# EAGLE schematic roomba_wall_v2_c (EAGLE 7.6.0)
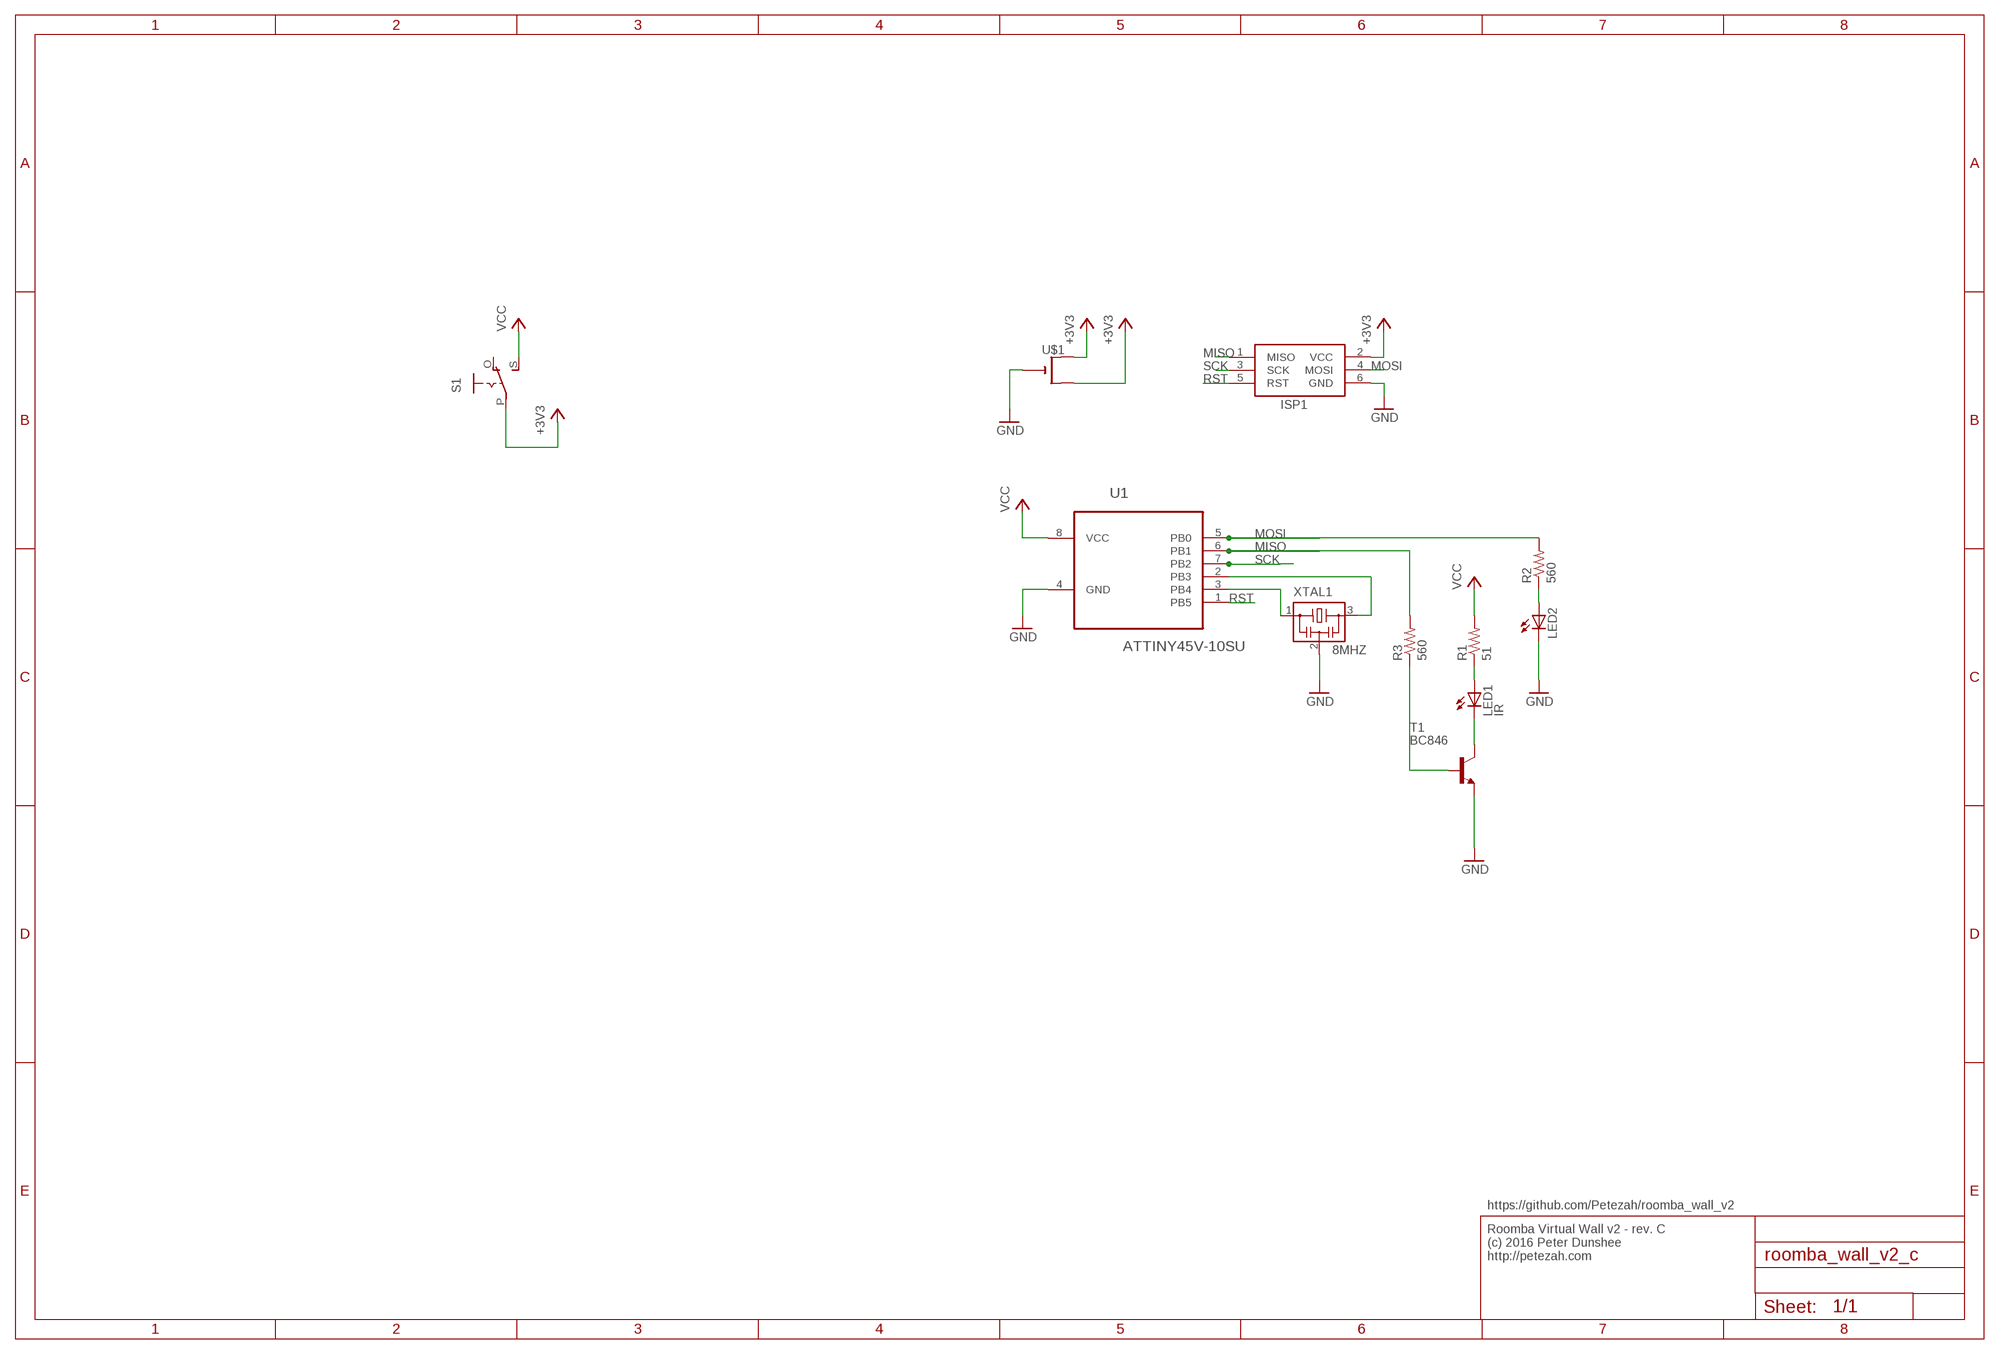
[diagram p0: schematic, sheet 1]

## Parts
ISP1  AVRISP-6  [AVRISP]
LED1  IR  LED3MM  [LED3MM]
LED2  LED3MM  [LED3MM]
R1  51  R-US_R1206  [R1206]
R2  560  R-US_R1206  [R1206]
R3  560  R-US_R1206  [R1206]
S1  EG1218S  [EG1218]
T1  BC846  [SOT23]
U1  ATTINY45V-10SU  [SOIC127P798X216-8N]
U$1  CR2032THM  [CR2032-THRU]
XTAL1  8MHZ  CSTCR6M00G53Z  [CSTCR6M]

## Nets
+3V3: ISP1.2(VCC) S1.P U$1.+1(+) U$1.+2(+1)
GND: ISP1.6(GND) LED2.K(C) T1.2(E) U$1.- XTAL1.2
MISO: ISP1.1(MISO) R3.2 U1.6(PB1)
MOSI: ISP1.4(MOSI) R2.2 U1.5(PB0)
N$1: U1.3(PB4) XTAL1.1
N$2: U1.2(PB3) XTAL1.3
N$3: LED1.A R1.1
N$4: LED1.K(C) T1.3(C)
N$5: R3.1 T1.1(B)
N$6: LED2.A R2.1
RST: ISP1.5(RST) U1.1(PB5)
SCK: ISP1.3(SCK) U1.7(PB2)
VCC: R1.2 S1.S
Unconnected: S1.O U1.4(GND)

## Notes on the sheet
- https://github.com/Petezah/roomba_wall_v2
- Roomba Virtual Wall v2 - rev. C
  (c) 2016 Peter Dunshee
  http://petezah.com

## Power pins joined to a net without a drawn wire
VCC: U1.8(VCC)

## Library data of the parts
ISP1 = adafruit:AVRISP: AVR ISP HEADER Standard 6 pin header for AVR programming
LED1 LED2 = adafruit:LED: LED OSRAM: - CHIPLED LG R971, LG N971, LY N971, LG Q971, LY Q971, LO R971, LY R971 LH N974, LH R974 LS Q976, LO Q976, LY Q976 LO Q996 - Hyper CHIPLED LW Q18S LB Q993, LB Q99A, LB R99A - SideLED LS A670, LO A670, LY A670, LG A670, LP A670 LB A673, LV A673, LT A673, LW A673 LH A674 LY A675 LS A676, LA A676, LO A676, LY A676, LW A676 LS A679, LY A679, LG A679 - Hyper Micro SIDELED® LS Y876, LA Y876, LO Y876, LY Y876 LT Y87S - SmartLED LW L88C, LW L88S LB L89C, LB L89S, LG L890 LS L89K, LO L89K, LY L89K LS L896, LA L896, LO L896, LY L896 - TOPLED LS T670, LO T670, LY T670, LG T670, LP T670 LSG T670, LSP T670, LSY T670, LOP T670, LYG T670 LG T671, LOG T671, LSG T671 LB T673, LV T673, LT T673, LW T673 LH T674 LS T676, LA T676, LO T676, LY T676, LB T676, LH T676, LSB T676, LW T676 LB T67C, LV T67C, LT T67C, LS T67K, LO T67K, LY T67K, LW E67C LS E67B, LA E67B, LO E67B, LY E67B, LB E67C, LV E67C, LT E67C LW T67C LS T679, LY T679, LG T679 LS T770, LO T770, LY T770, LG T770, LP T770 LB T773, LV T773, LT T773, LW T773 LH T774 LS E675, LA E675, LY E675, LS T675 LS T776, LA T776, LO T776, LY T776, LB T776 LHGB T686 LT T68C, LB T68C - Hyper Mini TOPLED® LB M676 - Mini TOPLED Santana® LG M470 LS M47K, LO M47K, LY M47K Source: http://www.osram.convergy.de/
R1-R3 = adafruit:R-US_: RESISTOR, American symbol
S1 = adafruit:EG1218: SLIDING SWITCH 0.1" spacing through hole, vertical SPDT slide switch http://www.ladyada.net/library/pcb/eaglelibrary.html
T1 = transistor:BC846: NPN TRANSISTOR
U1 = ATTINY45V-10SU:ATTINY45V-10SU: 8-bit Microcontroller with In-System Programmable Flash
U$1 = adafruit:CR2032
XTAL1 = murata-filter:CSTCR: Resonator Source: murata.co.jp; MPN: CSTCR6M00G53-R0; OC_FARNELL: 1170434; OC_NEWARK: 25M8759